# Altium schematic sheet Nucleo.SchDoc: Nucleo
size A4; Date: 2022 Fall; Address1: LK Bulls; Address2: Bagoly Zoltan; Address3: Feher Daniel; Address4: G. Varga Gabor; DocumentNumber: 2; Revision: 1.0; SheetNumber: 2; SheetTotal: 14
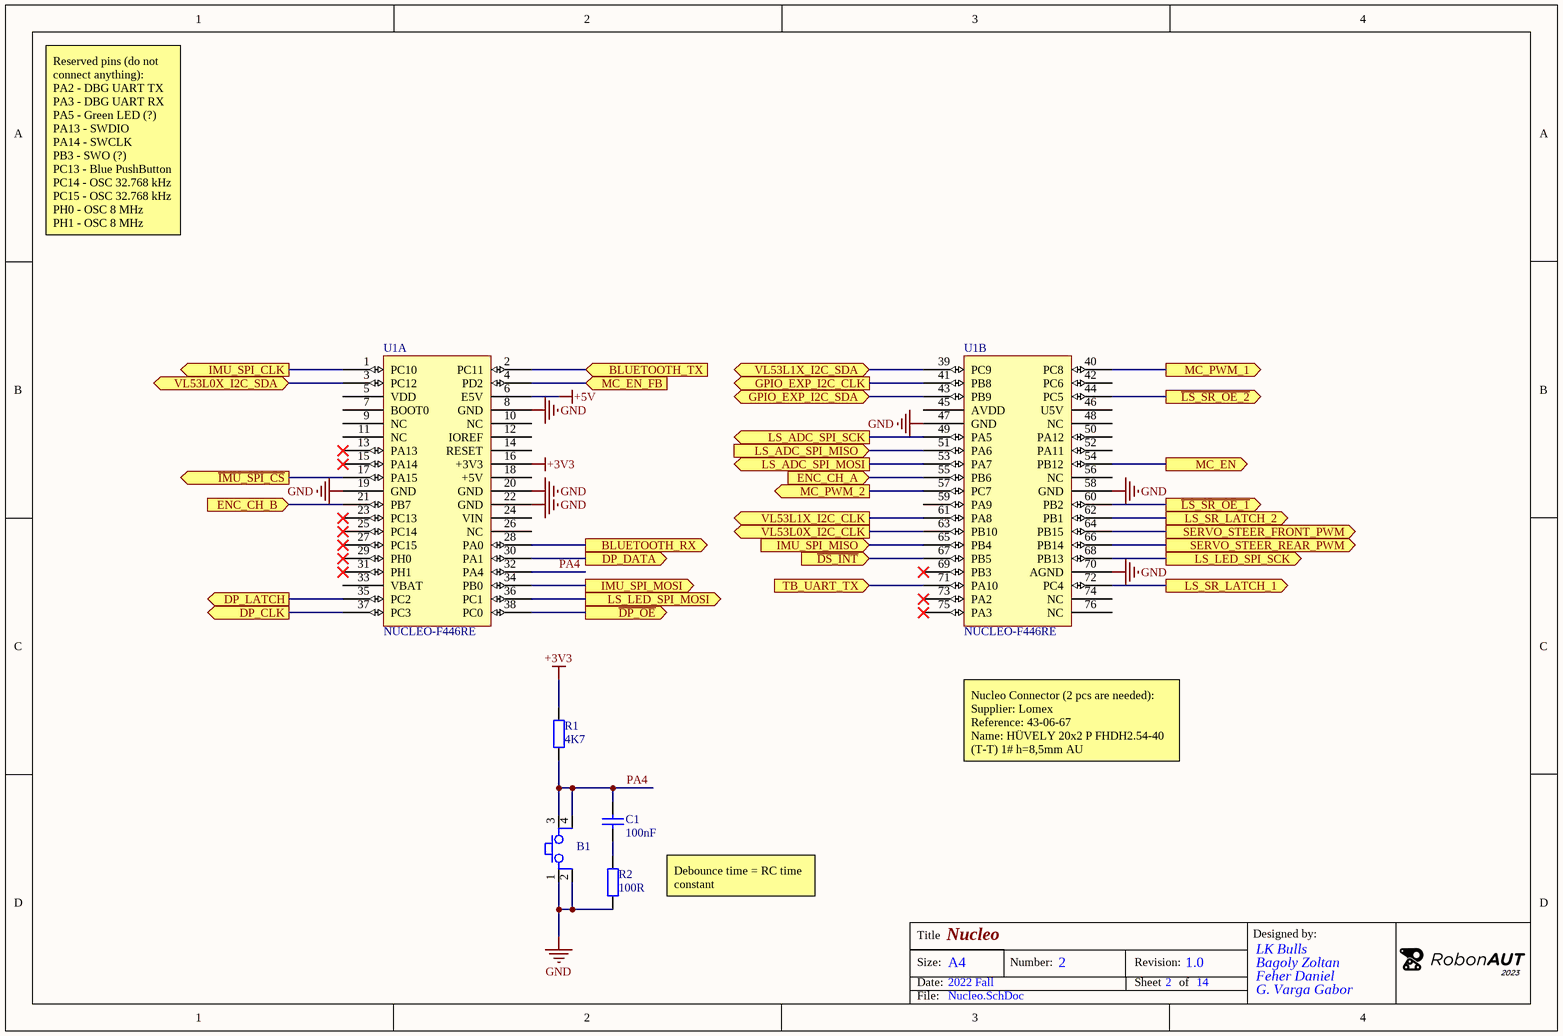
[diagram p0: Nucleo.SchDoc]

## Parts
B1  Button  [FP_BTN_SMD]  (value not drawn)
C1  100nF  [FP_0805_CAP_085]
R1  4K7  [FP_0805_RES]
R2  100R  [FP_0805_RES]
U1  NUCLEO-F446RE  [FP_NUCLEO-64]  (parts A,B of 2)

## Ports
BLUETOOTH_RX (out), BLUETOOTH_TX (in), DP_CLK (out), DP_DATA (out), DP_LATCH (out), ENC_CH_A (in), ENC_CH_B (in), GPIO_EXP_I2C_CLK (out), GPIO_EXP_I2C_SDA (bidir), IMU_SPI_CLK (out), IMU_SPI_MISO (in), IMU_SPI_MOSI (out), LS_ADC_SPI_MISO (in), LS_ADC_SPI_MOSI (out), LS_ADC_SPI_SCK (out), LS_LED_SPI_MOSI (out), LS_LED_SPI_SCK (out), LS_SR_LATCH_1 (out), LS_SR_LATCH_2 (out), MC_EN (out), MC_EN_FB (in), MC_PWM_1 (out), MC_PWM_2 (out), SERVO_STEER_FRONT_PWM (out), SERVO_STEER_REAR_PWM (out), TB_UART_TX (in), VL53L0X_I2C_CLK (out), VL53L0X_I2C_SDA (bidir), VL53L1X_I2C_CLK (out), VL53L1X_I2C_SDA (bidir), ~{DP_OE} (out), ~{DS_INT} (in), ~{IMU_SPI_CS} (out), ~{LS_SR_OE_1} (out), ~{LS_SR_OE_2} (out)

## Nets
+3V3: R1.2 U1.16(+3V3)
+5V: U1.6(E5V)
GND: B1.1 B1.2 R2.2 U1.8(GND) U1.19(GND) U1.20(GND) U1.22(GND) U1.47(GND) U1.58(GND) U1.70(AGND)
BLUETOOTH_RX: U1.28(PA0) ; port BLUETOOTH_RX
BLUETOOTH_TX: U1.2(PC11) ; port BLUETOOTH_TX
~{DP_OE}: U1.38(PC0) ; port ~{DP_OE}
~{DS_INT}: U1.67(PB5) ; port ~{DS_INT}
DP_CLK: U1.37(PC3) ; port DP_CLK
DP_DATA: U1.30(PA1) ; port DP_DATA
DP_LATCH: U1.35(PC2) ; port DP_LATCH
ENC_CH_A: U1.55(PB6) ; port ENC_CH_A
ENC_CH_B: U1.21(PB7) ; port ENC_CH_B
GPIO_EXP_I2C_CLK: U1.41(PB8) ; port GPIO_EXP_I2C_CLK
GPIO_EXP_I2C_SDA: U1.43(PB9) ; port GPIO_EXP_I2C_SDA
~{IMU_SPI_CS}: U1.17(PA15) ; port ~{IMU_SPI_CS}
IMU_SPI_CLK: U1.1(PC10) ; port IMU_SPI_CLK
IMU_SPI_MISO: U1.65(PB4) ; port IMU_SPI_MISO
IMU_SPI_MOSI: U1.34(PB0) ; port IMU_SPI_MOSI
~{LS_SR_OE_1}: U1.60(PB2) ; port ~{LS_SR_OE_1}
~{LS_SR_OE_2}: U1.44(PC5) ; port ~{LS_SR_OE_2}
LS_ADC_SPI_MISO: U1.51(PA6) ; port LS_ADC_SPI_MISO
LS_ADC_SPI_MOSI: U1.53(PA7) ; port LS_ADC_SPI_MOSI
LS_ADC_SPI_SCK: U1.49(PA5) ; port LS_ADC_SPI_SCK
LS_LED_SPI_MOSI: U1.36(PC1) ; port LS_LED_SPI_MOSI
LS_LED_SPI_SCK: U1.68(PB13) ; port LS_LED_SPI_SCK
LS_SR_LATCH_1: U1.72(PC4) ; port LS_SR_LATCH_1
LS_SR_LATCH_2: U1.62(PB1) ; port LS_SR_LATCH_2
MC_EN: U1.54(PB12) ; port MC_EN
MC_EN_FB: U1.4(PD2) ; port MC_EN_FB
MC_PWM_1: U1.40(PC8) ; port MC_PWM_1
MC_PWM_2: U1.57(PC7) ; port MC_PWM_2
PA4: B1.3 B1.4 C1.2 R1.1 U1.32(PA4)
SERVO_STEER_FRONT_PWM: U1.64(PB15) ; port SERVO_STEER_FRONT_PWM
SERVO_STEER_REAR_PWM: U1.66(PB14) ; port SERVO_STEER_REAR_PWM
TB_UART_TX: U1.71(PA10) ; port TB_UART_TX
VL53L0X_I2C_CLK: U1.63(PB10) ; port VL53L0X_I2C_CLK
VL53L0X_I2C_SDA: U1.3(PC12) ; port VL53L0X_I2C_SDA
VL53L1X_I2C_CLK: U1.61(PA8) ; port VL53L1X_I2C_CLK
VL53L1X_I2C_SDA: U1.39(PC9) ; port VL53L1X_I2C_SDA
NetC1_1: C1.1 R2.1

Not connected (* = marked no-connect by the designer): U1 5(VDD) 7(BOOT0) 9(NC) 10(NC) 11(NC) 12(IOREF) 13(PA13)* 14(RESET) 15(PA14)* 18(+5V) 23(PC13)* 24(VIN) 25(PC14)* 26(NC) 27(PC15)* 29(PH0)* 31(PH1)* 33(VBAT) 42(PC6) 45(AVDD) 46(U5V) 48(NC) 50(PA12) 52(PA11) 56(NC) 59(PA9) 69(PB3)* 73(PA2)* 74(NC) 75(PA3)* 76(NC)

## Notes on the sheet
- Reserved pins (do not connect anything):
  PA2 - DBG UART TX
  PA3 - DBG UART RX
  PA5 - Green LED (?)
  PA13 - SWDIO
  PA14 - SWCLK
  PB3 - SWO (?)
  PC13 - Blue PushButton
  PC14 - OSC 32.768 kHz
  PC15 - OSC 32.768 kHz
  PH0 - OSC 8 MHz
  PH1 - OSC 8 MHz
- Nucleo Connector (2 pcs are needed):
  Supplier: Lomex
  Reference: 43-06-67
  Name: HÜVELY 20x2 P FHDH2.54-40 (T-T) 1# h=8,5mm AU
- Debounce time = RC time constant
- Title
- Size:
- Date:
- A4
- Number:
- Revision:
- Sheet
- of
- Designed by:
- File:

## Library data of the parts
B1 = Button 4P: Push button; Reference: 100.224.61; Name: TACT-64N-F, Nyomógomb, mikrokapcsoló TACT, SPST-NO, THT, 4.3mm, 6x6mm; Supplier: Hestore
C1 = CAP: Capacitor; Tolerance: 10%; Voltage: 50V; Name: 100nF 0805 10% 50V X7R 0805B104K500NT (FNG); Supplier: Lomex; Reference: 82-13-46; Value: 100nF
R1 = RES: Resistor; Tolerance: 5%; Power: 0.125W; Name: 4K70 0805 5% CR-05JL7---4K7 0.125W (VIK); Supplier: Lomex; Reference: 81-10-95; Value: 4K7
R2 = RES: Resistor; Tolerance: 5%; Power: 0.125W; Name: 100R 0805 5% RC0805JR-10100RL 0.125W (YAG; Supplier: Lomex; Reference: 81-34-71; Value: 100R
U1 = NUCLEO-F446RE: Reference: NUCLEO; Name: Nucleo F446RE; Supplier: Tanszék